# EAGLE design HDC1080-Breakout_v10 (EAGLE 7.7.0)
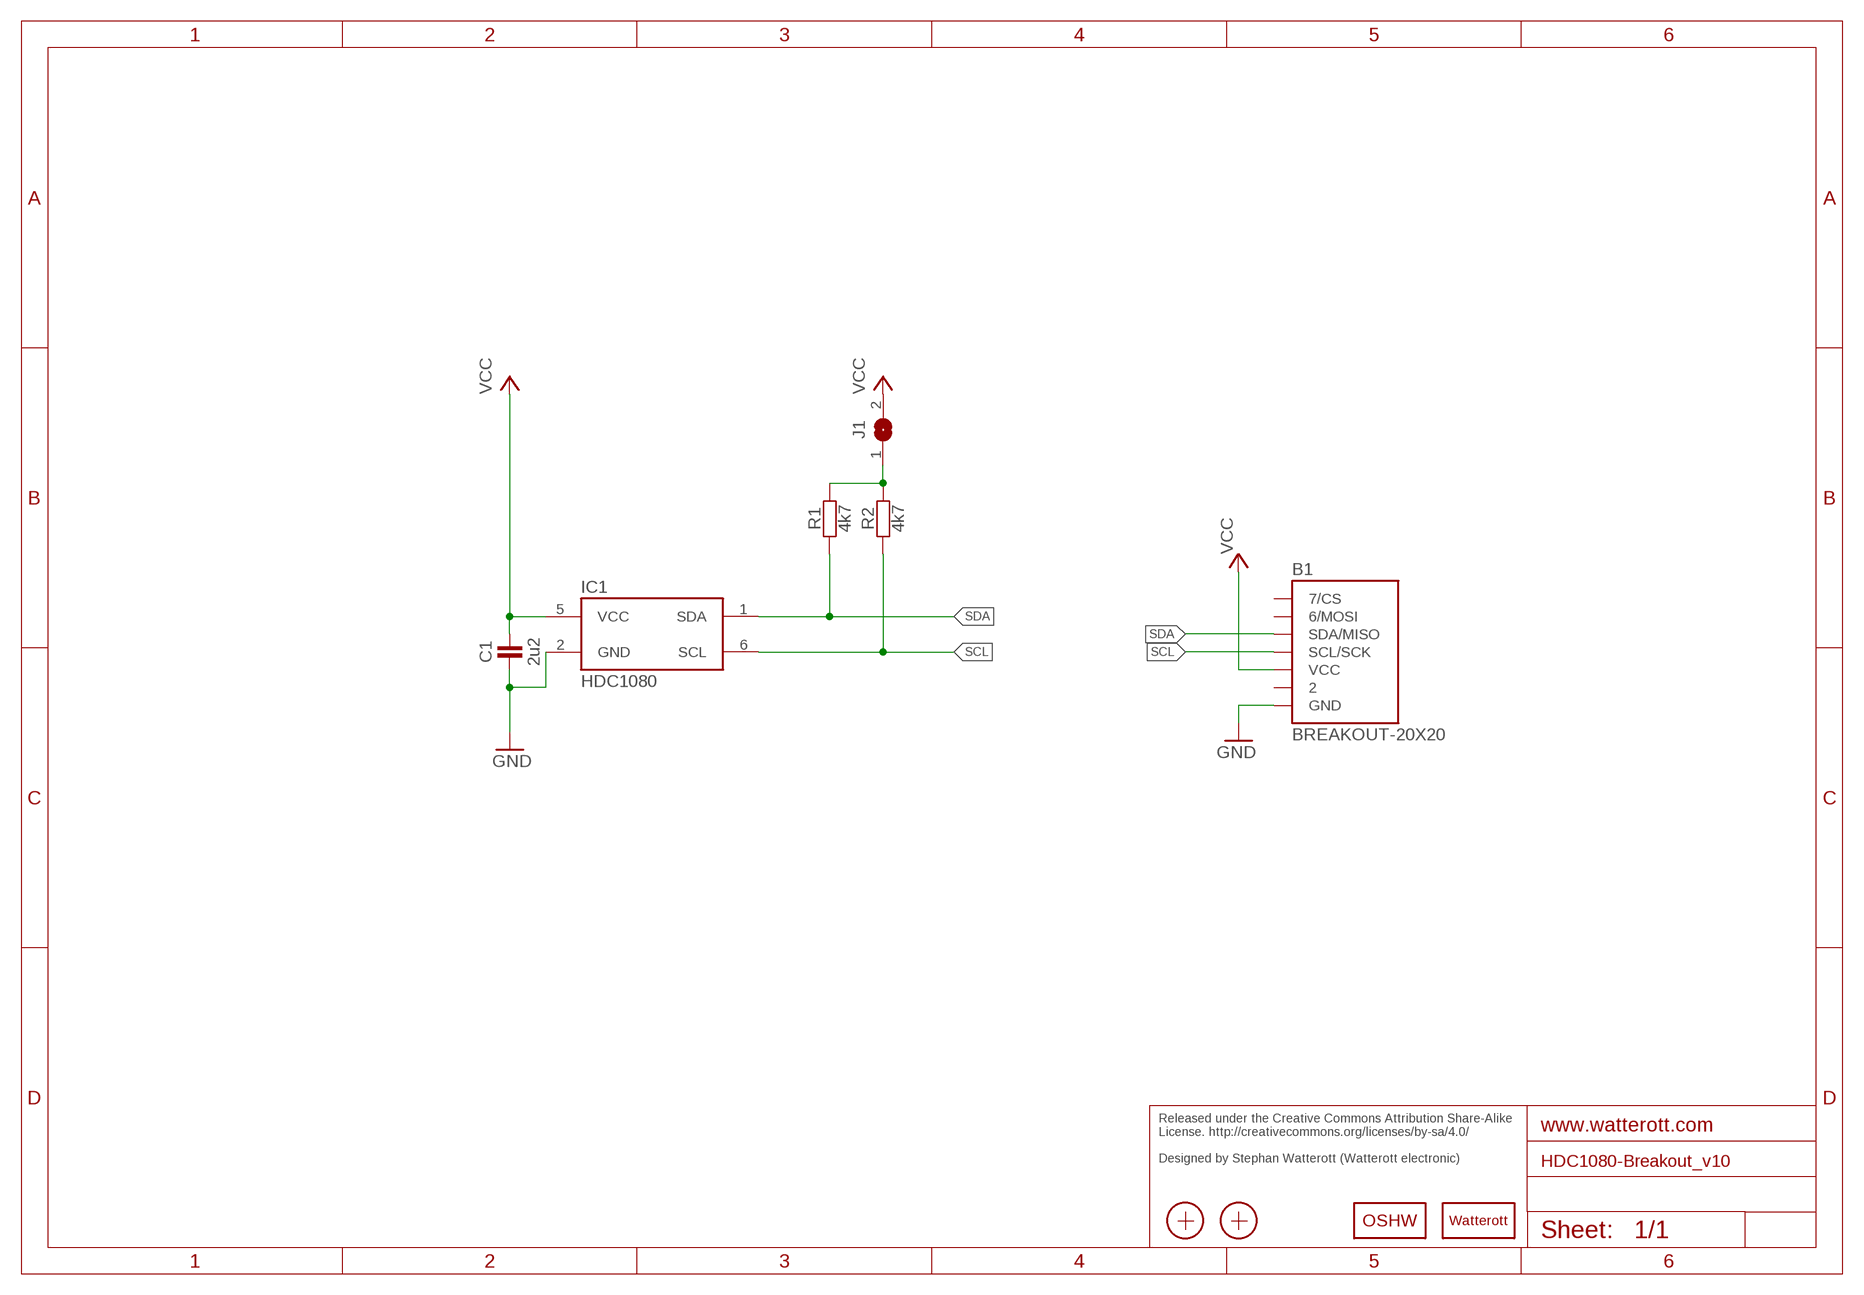
[diagram p0: schematic, sheet 1]

## Parts
B1  BREAKOUT-20X20  [BREAKOUT-20X20]
C1  2u2  CAPACITOR-C0402  [R0402]
IC1  HDC1080  [WSON6]
J1  JUMPER2-0603  [JUMPER2-0603]
LOGO2  OSHW_LOGOX0070  [OSHW_6X70]
LOGO3  LOGO-S_PLACE_M  [SPARK_TPLACE_M]
R1  4k7  RESISTOR-R0402  [R0402]
R2  4k7  RESISTOR-R0402  [R0402]
X1  PASSER-07  [PASSER_07MM]
X2  PASSER-07  [PASSER_07MM]

## Nets
GND: B1.GND C1.1 IC1.2(GND)
N$1: J1.1 R1.2 R2.2
SCL: B1.SCL/SCK IC1.6(SCL) R2.1
SDA: B1.SDA/MISO IC1.1(SDA) R1.1
VCC: B1.VCC C1.2 IC1.5(VCC) J1.2
Unconnected: B1.2 B1.CS(7/CS) B1.MOSI(6/MOSI)

## Notes on the sheet
- Released under the Creative Commons Attribution Share-Alike 
  License. http://creativecommons.org/licenses/by-sa/4.0/
  
  Designed by Stephan Watterott (Watterott electronic)

## Library data of the parts
B1 = we-board:BREAKOUT: Breakout Template
C1 = we-rcl:CAPACITOR: Capacitors ...4.7uF @ 6.3V -> 0402 ...10uF @ 16V -> 0603 ...22uF @ 25V -> 0805
IC1 = we-sensor:HDC1080
J1 = we-rcl:JUMPER2: 2 Pin Jumpers
LOGO2 = we-symbol:OSHW_LOGO: Open-Source-Hardware Logo
LOGO3 = we-symbol:LOGO: Watterott electronic Logo
R1 R2 = we-rcl:RESISTOR: Resistors all kinds in 0603 and 0402
X1 X2 = we-symbol:PASSER: Fiducial Markers

## Board
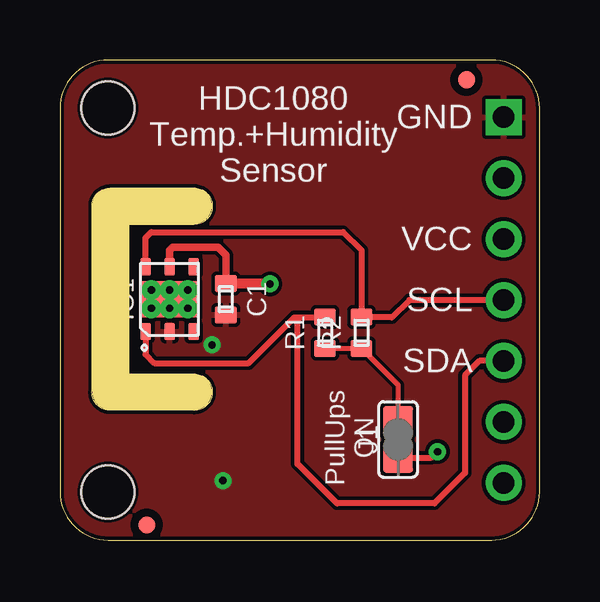
[diagram p1: board, top side]
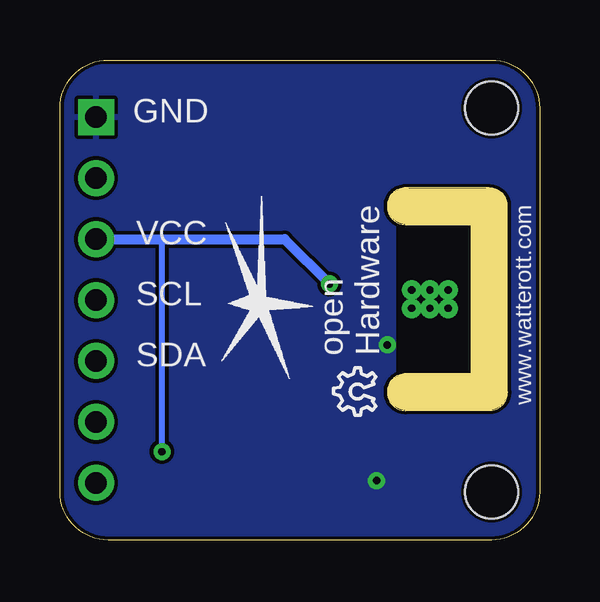
[diagram p2: board, bottom side, seen from below]

Size 20 x 20 mm. Coordinates in mm from the lower left corner, seen from the top.
Outline: 5.59,5.4 5.52,5.4
Outline: 5.52,5.4 2.03,5.4 arc-90 1.33,6.22 1.33,13.91 arc-90 2.1,14.67 5.65,14.67 arc-180 5.52,13.14 2.86,13.14 2.86,6.92 5.65,6.92 arc-180 5.52,5.4
Copper layers (1*16): Top 0.035mm / dielectric 1.5mm / Bottom 0.035mm
Design rules "watterott *": minimum track width 0.15mm, minimum drill 0.3mm, track to track 6mil, track to pad 8mil, pad to pad 6mil, via to via 6mil, smd to smd 0.1mm, copper to edge 6mil, drill to drill 8mil, minimum pad ring 10mil, minimum via ring 8mil, stop-mask expansion 4mil, vias tented up to drill 0.4mm, thermal gap 6mil
bRestrict: area 3,7.1 to 6,13
Milling: 3 lines

### Footprints (pad centres in the part's own frame; a part is rotated, then mirrored left to right if it is on the bottom)
BREAKOUT-20X20 = drill 0.9 pad 1.5: 2 18.5,15.08; CS 18.5,2.38; MOSI 18.5,4.92; SCL/SCK 18.5,10; SDA/MISO 18.5,7.46; VCC 18.5,12.54 | drill 0.9 pad 1.5 square: GND 18.5,17.62 | hole 2.2: 2,18; 2,2
R0402 = smd 0.9 x 0.7: 1 0,0.65; 2 0,-0.65
WSON6 = smd 0.7 x 0.45: 1 -1.35,1; 2 -1.35,0; 3 -1.35,-1; 4 1.35,-1; 5 1.35,0; 6 1.35,1 | smd 1.5 x 2.4: P$1 0,0 | drill 0.3 pad 0.61: P$2 -0.381,0.762; P$3 0.381,0.762; P$4 -0.381,0; P$5 -0.381,-0.762; P$6 0.381,0; P$7 0.381,-0.762
JUMPER2-0603 = smd 1.25 x 1.25: 1 0,0.76; 2 0,-0.76
PASSER_07MM = smd 0.7 x 0.7: X 0,0

### Placement (x,y rotation side)
B1  0,0 0 top
C1  6.92,10.03 180 top
IC1  4.57,10.03 90 top
J1  14.1,4.19 0 top
LOGO2  6.81,5.2 90 bottom
LOGO3  11.68,9.91 90 bottom
R1  11.05,8.64 0 top
R2  12.57,8.64 0 top
X1  16.95,19.18 0 top
X2  3.62,0.63 0 top

### Tracks (layer width: path | path; a pad name or v marks a point on that pad's centre or on a via)
GND  (via drill 0.3)
  other vias: 6.79,2.48 6.35,8.13
  pour Top: 0,0 0,20.07 19.81,20.07 20.07,19.81 20.07,0
  pour Bottom: 0,0 0,20.07 19.81,20.07 20.07,19.81 20.07,0
N$1
  Top 0.2: R1.2 R2.2 14.1,6.46 J1.1
N$2
  Top 0.254: 14.1,3.56 14.1,4.83
SCL
  Top 0.254: IC1.6 3.57,12.59 3.81,12.83 11.81,12.83 12.57,12.06 R2.1 12.59,9.27 13.84,9.27 14.57,10 B1.SCL/SCK
SDA
  Top 0.254: IC1.1 3.57,7.73 3.94,7.37 7.87,7.37 9.78,9.27 10.03,9.27 | 10.03,9.27 11.03,9.27 R1.1 | B1.SDA/MISO 17.49,7.46 16.89,6.86 16.89,2.79 15.62,1.52 11.56,1.52 9.91,3.17 9.91,9.14 10.03,9.27
VCC  (via drill 0.3)
  Top 0.254: J1.2 15.5,3.43 v15.75,3.68
  Top 0.305: C1.2 6.92,11.87 6.6,12.19 4.7,12.19 4.57,12.06 IC1.5
  Top 0.406: v8.76,10.67 6.94,10.67 C1.2
  Bottom 0.254: v15.75,3.68 15.75,12.54
  Bottom 0.406: B1.VCC 15.75,12.54 10.63,12.54 v8.76,10.67

### Text on the board
tPlace: GND | HDC1080 / Temp.+Humidity / Sensor | VCC | SCL | SDA | PullUps / ON
bPlace: GND | VCC | www.watterott.com | SCL | open / Hardware | SDA
Reference: Silkscreen: 21 tPlace + 22 bPlace